# EasyEDA Pro project ADC2PWM_内置ESC.epro

# Schematic Schematic1_4
Board Name: 带屏幕_TPS63070_1; Create Date: 2026-05-16; Page Name: P1; Project Name: ADC2PWM; Schematic Name: Schematic1_3; Update Date: 2026-05-16; Company: 嘉立创EDA; Page Size: A4; Version: V1.0
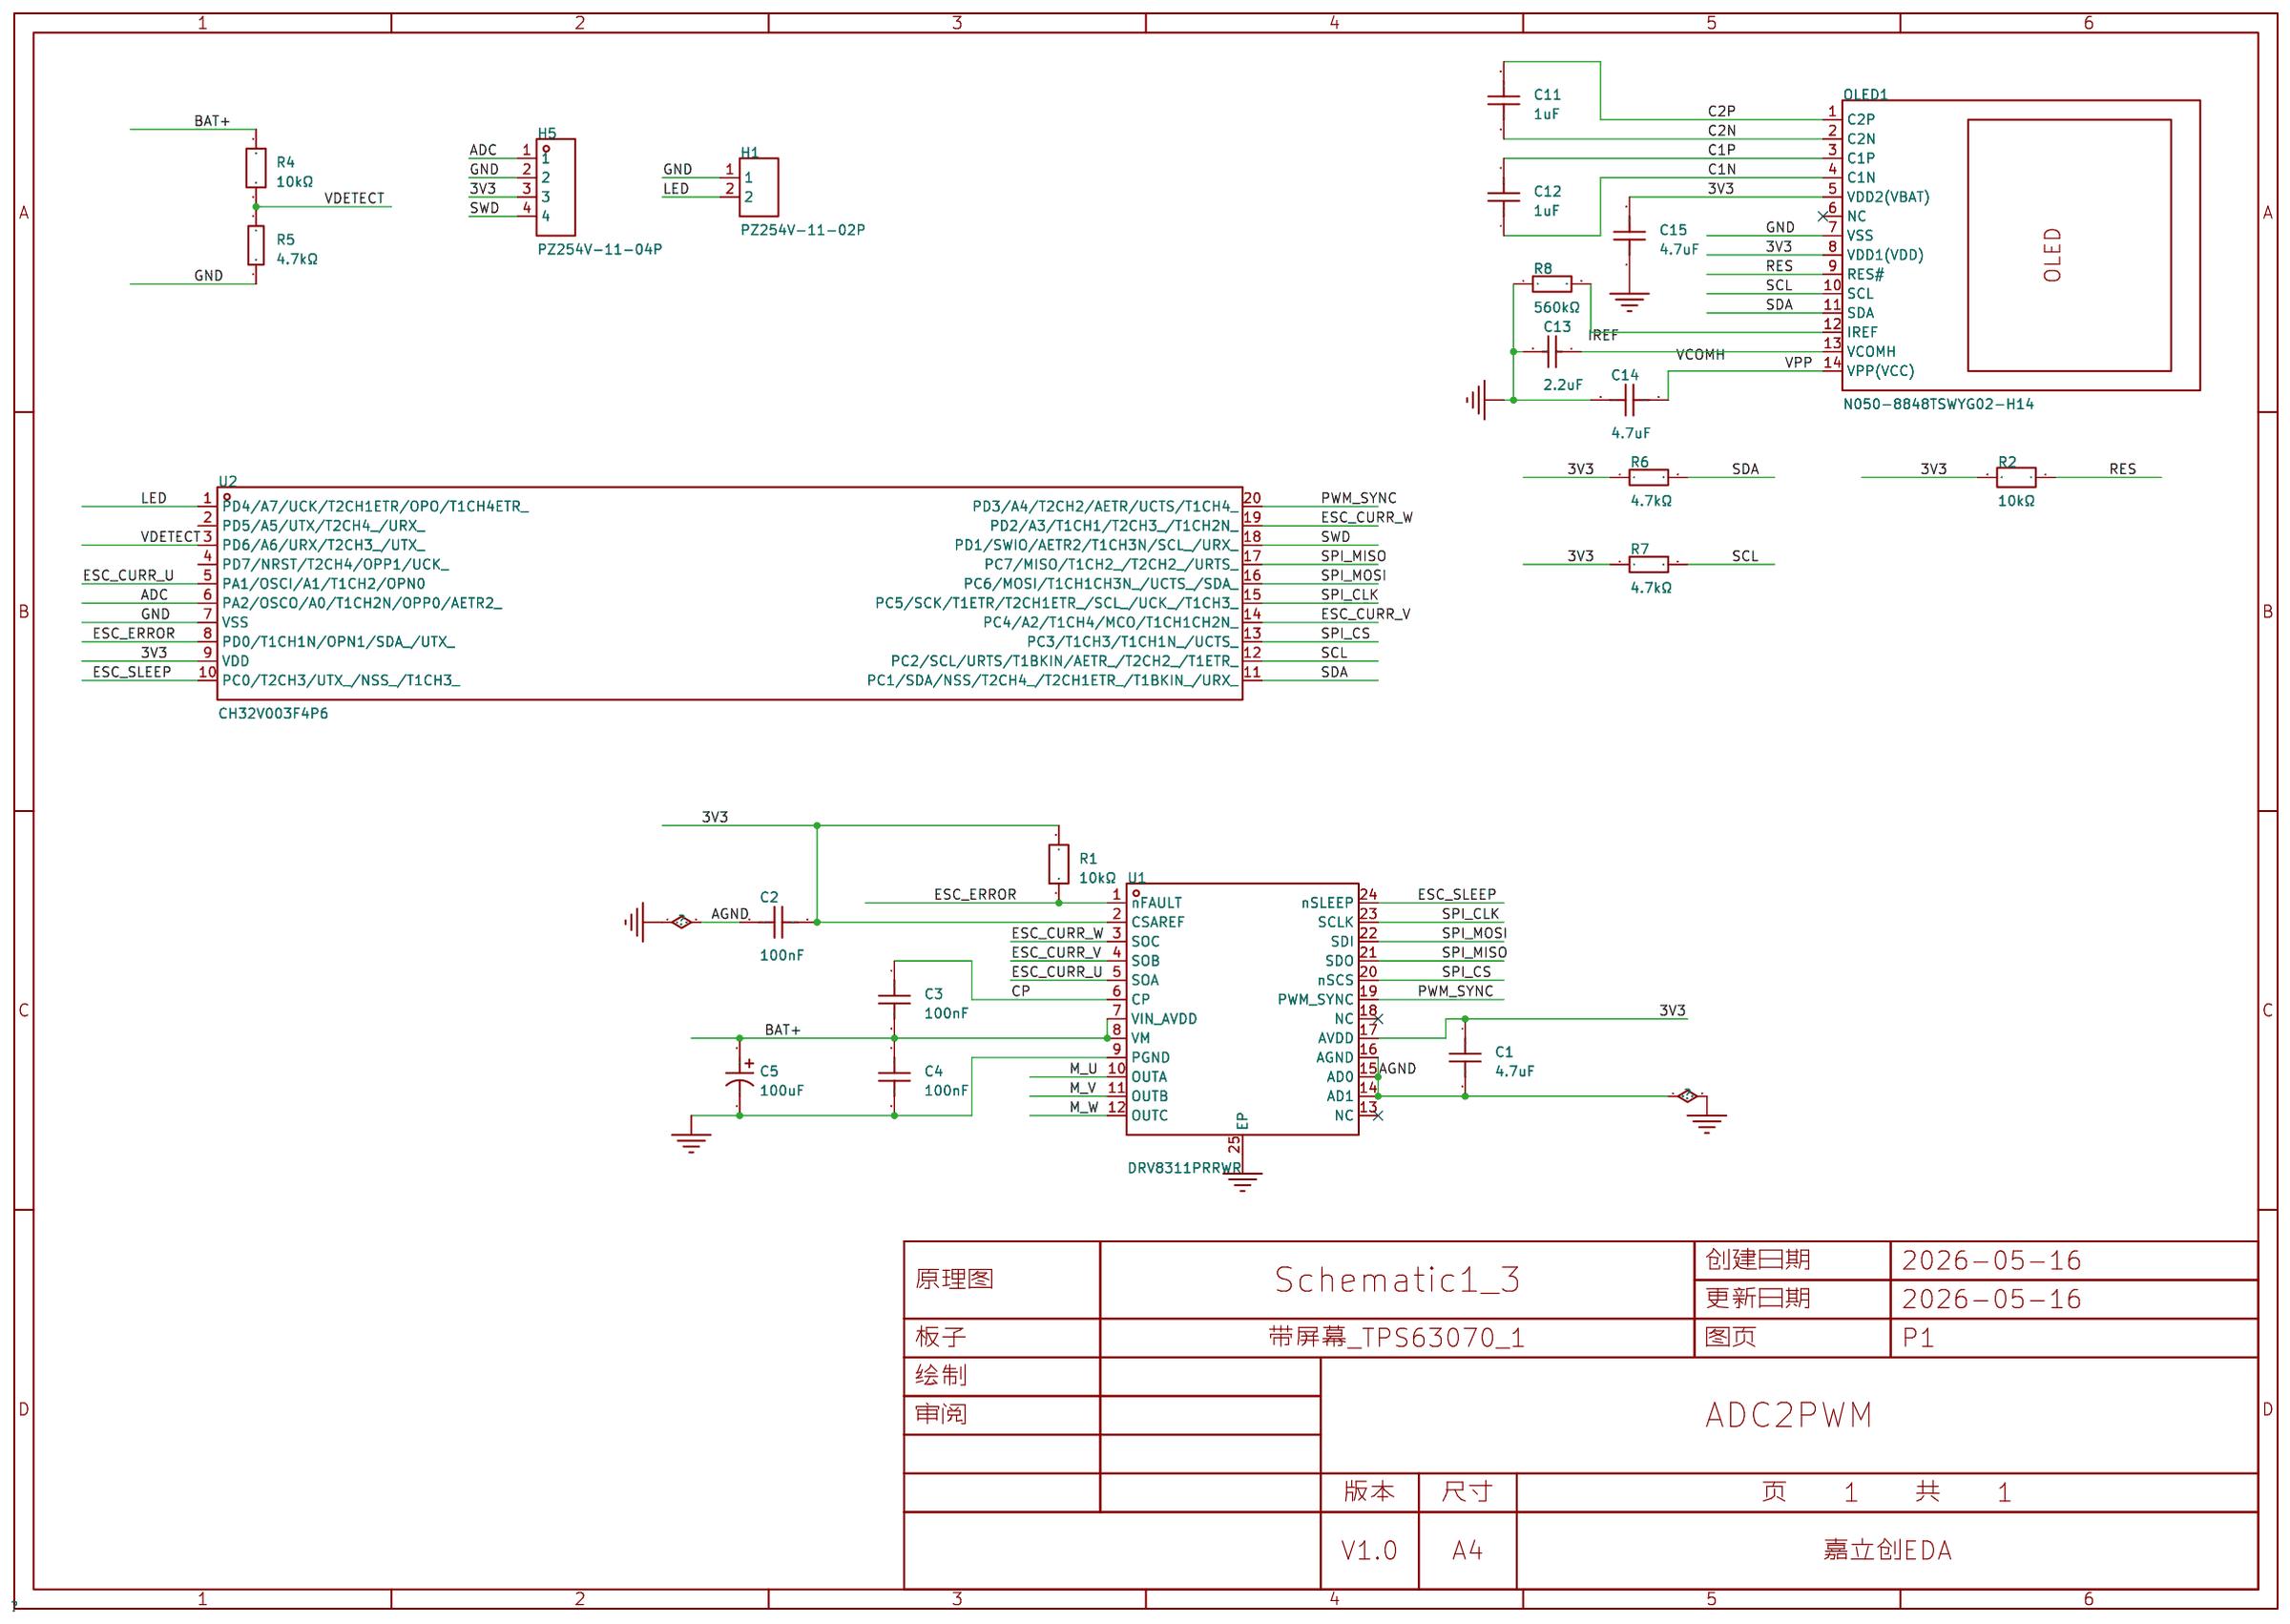
[diagram p0: schematic sheet]

## Parts
C1  4.7uF  [C0603]
C2  100nF  [C0603]
C3  100nF  [C0603]
C4  100nF  [C0603]
C5  100uF  [CAP-SMD_BD6.3-L6.6-W6.6-LS7.2-FD_3]
C11  1uF  [C0603]
C12  1uF  [C0603]
C13  2.2uF  [C0603]
C14  4.7uF  [C0603]
C15  4.7uF  [C0603]
H1  PZ254V-11-02P  [HDR-TH_2P-P2.54-V-M]
H5  PZ254V-11-04P  [HDR-TH_4P-P2.54-V-M]
OLED1  N050-8848TSWYG02-H14  [OLED-SMD_N050-8848TSWYG02-H14]
R1  10kΩ  [R0603]
R2  10kΩ  [R0603]
R4  10kΩ  [R0603]
R5  4.7kΩ  [R0603]
R6  4.7kΩ  [R0603]
R7  4.7kΩ  [R0603]
R8  560kΩ  [R0603]
U1  DRV8311PRRWR  [QFN-24_L3.0-W3.0-P0.40_DRV8311PRRWR]
U2  CH32V003F4P6  [TSSOP-20_L6.5-W4.4-P0.65-LS6.4-BL]

## Library data of the parts
C1 = GRM188Z71C475KE21D: 容值:4.7uF;精度:±10%;额定电压:16V;温度系数:X7R;; LCSC Part Name: 4.7uF ±10% 16V; Supplier Part: C389010; Manufacturer: muRata(村田); Supplier Footprint: 0603; JLCPCB Part Class: Extended Part; Datasheet: https://item.szlcsc.com/datasheet/GRM188Z71C475KE21D/364359.html; Supplier: LCSC; Tolerance: ±10%; Voltage Rating: 16V; Temperature Coefficient: X7R
C2-C4 = CGA0603X7R104K500JT: 容值:100nF;精度:±10%;额定电压:50V;温度系数:X7R;; LCSC Part Name: 100nF ±10% 50V; Supplier Part: C6119867; Manufacturer: HRE(芯声); Supplier Footprint: 0603; JLCPCB Part Class: 扩展库; Datasheet: https://item.szlcsc.com/datasheet/CGA0603X7R104K500JT/7062573.html; Supplier: LCSC; Tolerance: ±10%; Voltage Rating: 50V; Temperature Coefficient: X7R
C5 = JVJ16V100M6x5: 容值:100uF;精度:±20%;额定电压:16V;纹波电流:60mA@120Hz;; LCSC Part Name: 100uF ±20% 16V; Supplier Part: C46550396; Manufacturer: JIERR(捷而瑞); Supplier Footprint: SMD,D6.3xL5.4mm; JLCPCB Part Class: Extended Part; Datasheet: https://item.szlcsc.com/datasheet/JVJ16V100M6x5/48680090.html; Supplier: LCSC; Tolerance: ±20%; Voltage Rating: 16V; Ripple Current: 60mA@120Hz; Diameter: 6.3mm; Height - Seated (Max): 5.4mm; Lifetime: 2000hrs@105℃; Operating Temperature: -55℃~+105℃
C11 C12 = CGA0603X5R105K500JT: 容值:1uF;精度:±10%;额定电压:50V;温度系数:X5R;; LCSC Part Name: 1uF ±10% 50V; Supplier Part: C6119852; Manufacturer: HRE(芯声); Supplier Footprint: 0603; JLCPCB Part Class: 扩展库; Datasheet: https://item.szlcsc.com/datasheet/CGA0603X5R105K500JT/7062558.html; Supplier: LCSC; Tolerance: ±10%; Voltage Rating: 50V; Temperature Coefficient: X5R
C13 = CL10A225KO8NNNC: 容值:2.2uF;精度:±10%;额定电压:16V;温度系数:X5R;; LCSC Part Name: 2.2uF ±10% 16V; Supplier Part: C23630; Manufacturer: SAMSUNG(三星); Supplier Footprint: 0603; JLCPCB Part Class: 基础库; Datasheet: https://item.szlcsc.com/datasheet/CL10A225KO8NNNC/24366.html; Supplier: LCSC; Tolerance: ±10%; Voltage Rating: 16V; Temperature Coefficient: X5R
C14 C15 = CGA0603X5R475K250JT: 容值:4.7uF;精度:±10%;额定电压:25V;温度系数:X5R;; LCSC Part Name: 4.7uF ±10% 25V; Supplier Part: C6119856; Manufacturer: HRE(芯声); Supplier Footprint: 0603; JLCPCB Part Class: 扩展库; Datasheet: https://item.szlcsc.com/datasheet/CGA0603X5R475K250JT/7062562.html; Supplier: LCSC; Tolerance: ±10%; Voltage Rating: 25V; Temperature Coefficient: X5R
H1 = PZ254V-11-02P: 插针结构:1x2P;间距:2.54mm;行距:-;圆针/方针:方针;安装方式:直插;排数:单排;总PIN位数:2P;额定电流:3A;额定电压:250V;配合针长度:6mm;塑高:2.5mm;端接针长度:3mm;触头材质:黄铜;触头镀层:-;工作温度:-40℃~+105℃;颜色:黑色;; LCSC Part Name: 1x2P 间距:2.54mm 方针 直插; Supplier Part: C492401; Manufacturer: XFCN(兴飞); Supplier Footprint: 插件,P=2.54mm; JLCPCB Part Class: Extended Part; Datasheet: https://item.szlcsc.com/datasheet/PZ254V-11-02P/502957.html; Supplier: LCSC; Pin Structure: 1x2P; Pitch: 2.54mm; Circluar Pins/Square Pins: 方针; Mounting Type: 直插; Number of Rows: 单排; Number of Pins: 2P; Current Rating: 3A; Voltage Rating (Max): 250V; Length of Mating Pin: 6mm; Insulation Height: 2.5mm; Length of End Connection Pin: 3mm; Contact Material: 黄铜; Operating Temperature: -40℃~+105℃; Color: 黑色
H5 = PZ254V-11-04P: 插针结构:1x4P;间距:2.54mm;行距:-;圆针/方针:方针;安装方式:直插;排数:单排;总PIN位数:4P;额定电流:3A;额定电压:250V;配合针长度:6mm;塑高:2.5mm;端接针长度:3mm;触头材质:-;工作温度:-40℃~+105℃;颜色:黑色;; LCSC Part Name: 1x4P 间距:2.54mm 方针 直插; Supplier Part: C2691448; Manufacturer: XFCN(兴飞); Supplier Footprint: 插件,P=2.54mm; JLCPCB Part Class: 扩展库; Datasheet: https://item.szlcsc.com/datasheet/PZ254V-11-04P/2801085.html; Supplier: LCSC; Pin Structure: 1x4P; Pitch: 2.54mm; Circluar Pins/Square Pins: 方针; Mounting Type: 直插; Number of Rows: 单排; Number of Pins: 4P; Current Rating: 3A; Voltage Rating (Max): 250V; Length of Mating Pin: 6mm; Insulation Height: 2.5mm; Length of End Connection Pin: 3mm; Operating Temperature: -40℃~+105℃; Color: 黑色
OLED1 = N050-8848TSWYG02-H14: 核心芯片:CH1115芯片;尺寸(inch):0.5;像素分辨率:88x48;; LCSC Part Name: 0.50寸 白光 88x48像素分辨率 14PIN; Supplier Part: C2890604; Manufacturer: Wisevision(新智景); JLCPCB Part Class: 扩展库; Datasheet: https://item.szlcsc.com/datasheet/N050-8848TSWYG02-H14/3115552.html; Supplier: LCSC; Controller Type: CH1115芯片; Size: 0.5; Dot Pixels: 88x48; Operating Temperature: -40℃~+85℃; Type of Drive: 无源(PMOLED); Display Range: 6.124x11.244mm; Display Color: 白色; Luminance: 100cd/m2
R1 R2 R4 = FRC0603F1002TS: 电阻类型:厚膜电阻;阻值:10kΩ;精度:±1%;功率:100mW;工作电压:75V;温度系数:±100ppm/℃;; LCSC Part Name: 10kΩ ±1% 100mW 厚膜电阻; Supplier Part: C2906982; Manufacturer: FOJAN(富捷); Supplier Footprint: 0603; JLCPCB Part Class: 扩展库; Supplier: LCSC; Type: 厚膜电阻; Tolerance: ±1%; Power(Watts): 100mW; Voltage-Supply(Max): 75V; Temperature Coefficient: ±100ppm/℃; Operating Temperature: -55℃~+155℃
R5 = 0603WAF4701T5E: 电阻类型:厚膜电阻;阻值:4.7kΩ;精度:±1%;功率:100mW;工作电压:75V;温度系数:±100ppm/℃;; LCSC Part Name: 4.7kΩ ±1% 100mW 厚膜电阻; Supplier Part: C23162; Manufacturer: UNI-ROYAL(厚声); Supplier Footprint: 0603; JLCPCB Part Class: 基础库; Datasheet: https://item.szlcsc.com/datasheet/0603WAF4701T5E/23889.html; Supplier: LCSC; Type: 厚膜电阻; Tolerance: ±1%; Power(Watts): 100mW; Voltage-Supply(Max): 75V; Temperature Coefficient: ±100ppm/℃; Operating Temperature: -55℃~+155℃
R6 R7 = RC0603FR-074K7L: 电阻类型:厚膜电阻;阻值:4.7kΩ;精度:±1%;功率:100mW;工作电压:75V;温度系数:±100ppm/℃;; LCSC Part Name: 厚膜电阻 4.7kΩ ±1% 100mW; Supplier Part: C99782; Manufacturer: YAGEO(国巨); Supplier Footprint: 0603; JLCPCB Part Class: 扩展库; Datasheet: https://item.szlcsc.com/datasheet/RC0603FR-074K7L/100996.html; Supplier: LCSC; Type: 厚膜电阻; Tolerance: ±1%; Power(Watts): 100mW; Voltage-Supply(Max): 75V; Temperature Coefficient: ±100ppm/℃; Operating Temperature: -55℃~+155℃
R8 = RC0603FR-07560KL: 电阻类型:厚膜电阻;阻值:560kΩ;精度:±1%;功率:100mW;最大工作电压:75V;温度系数:±100ppm/℃;; LCSC Part Name: 厚膜电阻 560kΩ ±1% 100mW; Supplier Part: C137699; Manufacturer: YAGEO(国巨); Supplier Footprint: 0603; JLCPCB Part Class: 扩展库; Datasheet: https://atta.szlcsc.com/upload/public/pdf/source/20180821/C275644_0D56F95EFF785E7D9A1FEF436B37DA78.pdf; Supplier: LCSC; Type: 厚膜电阻; Tolerance: ±1%; Power(Watts): 100mW; Overload Voltage (Max): 75V; Temperature Coefficient: ±100ppm/℃; Operating Temperature Range: -55℃~+155℃
U1 = DRV8311PRRWR: DRV8311 具有集成 FET、最大绝对电压为 24V 的 3V 至 20V 三相无刷直流电机驱动器; LCSC Part Name: 5A 无刷直流BLDC电机驱动芯片 20V; Supplier Part: C3681458; Manufacturer: TI(德州仪器); Supplier Footprint: WQFN-24(3x3); JLCPCB Part Class: Extended Part; Datasheet: https://www.ti.com/cn/lit/gpn/drv8311; Supplier: LCSC; Drive Type: 三相；三相; Integrated FETs: 是；是; Number of Half Bridges: 3；3; Peak Current: 5A；5A; RDS(on): 210mΩ；210mΩ; Quiescent Current(Iq): 12mA；12mA; Interface: SPI; Operating Temperature: -40℃~+125℃；-40℃~+125℃
U2 = CH32V003F4P6: LCSC Part Name: QingKe V2微处理器; Supplier Part: C5187096; Manufacturer: WCH(南京沁恒); Supplier Footprint: TSSOP-20-175mil; JLCPCB Part Class: Extended Part; Datasheet: https://item.szlcsc.com/datasheet/CH32V003F4P6/5858783.html; Supplier: LCSC

## Nets
3V3: C1.1 C2.2 C15.2 H5.3 OLED1.5(VDD2(VBAT)) OLED1.8(VDD1(VDD)) R1.2 R2.2 R6.1 R7.1 U1.2(CSAREF) U1.17(AVDD) U2.9(VDD)
GND: C1.2 C2.1 C4.2 C5.2 C13.2 C14.2 C15.1 H1.1 H5.2 OLED1.7(VSS) R5.1 R8.1 U1.9(PGND) U1.14(AD1) U1.15(AD0) U1.16(AGND) U1.25(EP) U2.7(VSS)
ADC: H5.1 U2.6(PA2/OSCO/A0/T1CH2N/OPP0/AETR2_)
BAT+: C3.2 C4.1 C5.1 R4.2 U1.7(VIN_AVDD) U1.8(VM)
C1N: C12.1 OLED1.4(C1N)
C1P: C12.2 OLED1.3(C1P)
C2N: C11.1 OLED1.2(C2N)
C2P: C11.2 OLED1.1(C2P)
CP: C3.1 U1.6(CP)
ESC_CURR_U: U1.5(SOA) U2.5(PA1/OSCI/A1/T1CH2/OPN0)
ESC_CURR_V: U1.4(SOB) U2.14(PC4/A2/T1CH4/MCO/T1CH1CH2N_)
ESC_CURR_W: U1.3(SOC) U2.19(PD2/A3/T1CH1/T2CH3_/T1CH2N_)
ESC_ERROR: R1.1 U1.1(nFAULT) U2.8(PD0/T1CH1N/OPN1/SDA_/UTX_)
ESC_SLEEP: U1.24(nSLEEP) U2.10(PC0/T2CH3/UTX_/NSS_/T1CH3_)
IREF: OLED1.12(IREF) R8.2
LED: H1.2 U2.1(PD4/A7/UCK/T2CH1ETR/OPO/T1CH4ETR_)
M_U: U1.10(OUTA)
M_V: U1.11(OUTB)
M_W: U1.12(OUTC)
PWM_SYNC: U1.19(PWM_SYNC) U2.20(PD3/A4/T2CH2/AETR/UCTS/T1CH4_)
RES: OLED1.9(RES#) R2.1
SCL: OLED1.10(SCL) R7.2 U2.12(PC2/SCL/URTS/T1BKIN/AETR_/T2CH2_/T1ETR_)
SDA: OLED1.11(SDA) R6.2 U2.11(PC1/SDA/NSS/T2CH4_/T2CH1ETR_/T1BKIN_/URX_)
SPI_CLK: U1.23(SCLK) U2.15(PC5/SCK/T1ETR/T2CH1ETR_/SCL_/UCK_/T1CH3_)
SPI_CS: U1.20(nSCS) U2.13(PC3/T1CH3/T1CH1N_/UCTS_)
SPI_MISO: U1.21(SDO) U2.17(PC7/MISO/T1CH2_/T2CH2_/URTS_)
SPI_MOSI: U1.22(SDI) U2.16(PC6/MOSI/T1CH1CH3N_/UCTS_/SDA_)
SWD: H5.4 U2.18(PD1/SWIO/AETR2/T1CH3N/SCL_/URX_)
VCOMH: C13.1 OLED1.13(VCOMH)
VDETECT: R4.1 R5.2 U2.3(PD6/A6/URX/T2CH3_/UTX_)
VPP: C14.1 OLED1.14(VPP(VCC))

Not connected (* = marked no-connect by the designer): OLED1 6(NC)*; U1 13(NC)* 18(NC)*; U2 2(PD5/A5/UTX/T2CH4_/URX_) 4(PD7/NRST/T2CH4/OPP1/UCK_)

# Board PCB1_4
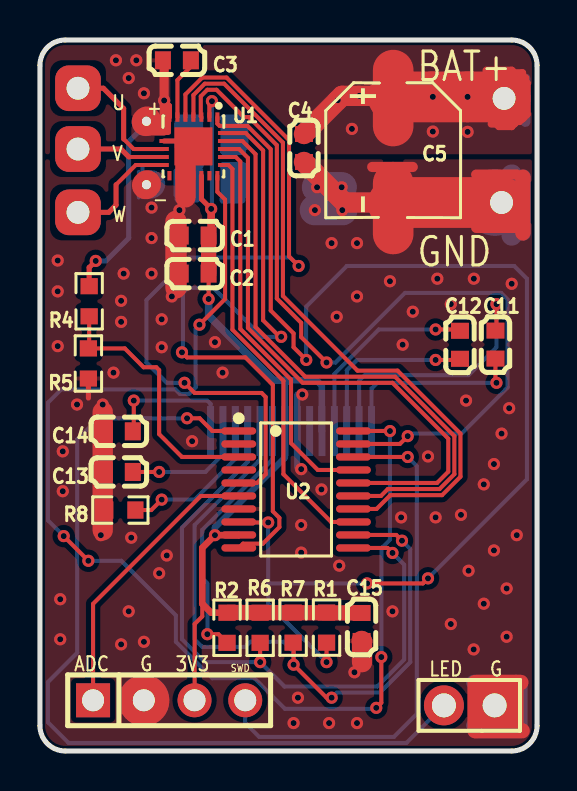
[diagram p1: board, top side]
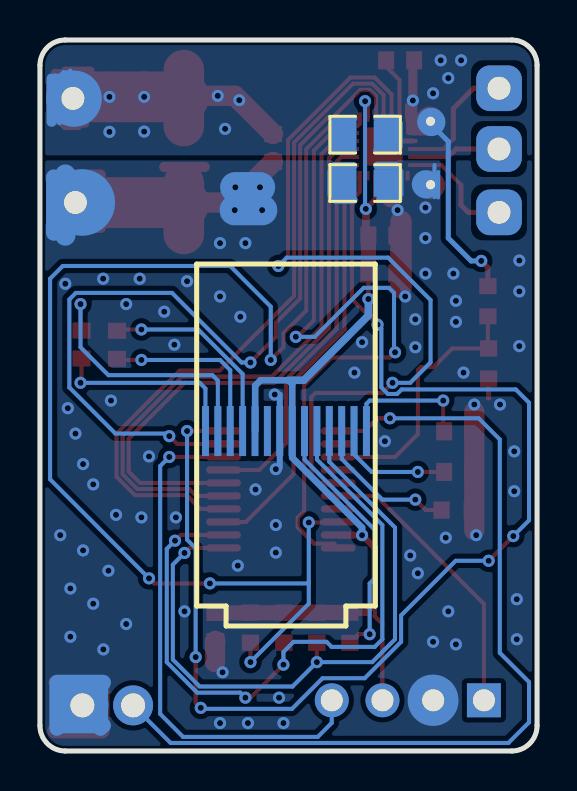
[diagram p2: board, bottom side, seen from below]

Outline 24.89 x 35.56 mm; copper layers: Top Layer, Bottom Layer. Coordinates in mm from the lower left corner of the outline.
Outline path: 0,34.29 0,1.27 arc(0.37,0.37) 1.27,0 23.62,0 arc(24.52,0.37) 24.89,1.27 24.89,34.29 arc(24.52,35.19) 23.62,35.56 1.27,35.56 arc(0.37,35.19) 0,34.29
Stack: Top Layer 0.035mm / Dielectric1 1.51mm FR4 er 4.5 / Bottom Layer 0.035mm

## Design rules (mm)
spacing copperThickness1oz (default): track to track 0.102, other pairs 0.152 to 0.3
spacing copperThickness2oz: track to track 0.203, other pairs 0.152 to 0.3
spacing Plane_innerPlane: track to track 0.102, other pairs 0.152 to 0.3
spacing Copper_copperRegion: track to track 0.102, other pairs 0.152 to 0.3
track width copperThickness1oz (default): min 0.127, default 0.203, max 2.54
track width copperThickness2oz: min 0.203, default 0.254, max 2.54
track width power: min 0.254, default 0.254, max 2.54
differential pair differentialPair (default): width min 0.127, default 0.254, max 2.54; gap min 0.152, default 0.152
net BAT+ uses copperRegion_copperThickness1oz, power
net GND uses copperRegion_copperThickness1oz, power
pour e160 uses Copper_copperRegion, copperRegion_Copper_copperRegion
pour e209 uses Copper_copperRegion, copperRegion_Copper_copperRegion

## Placement (name value [footprint] x y rotation side)
C1  4.7uF  [C0603]  7.75 25.78 180 top
C2  100nF  [C0603]  7.75 23.88 0 top
C3  100nF  [C0603]  6.86 34.54 180 top
C4  100nF  [C0603]  13.22 30.16 270 top
C5  100uF  [CAP-SMD_BD6.3-L6.6-W6.6-LS7.2-FD_3]  17.69 30.05 270 top
C11  1uF  [C0603]  22.81 20.32 270 top
C12  1uF  [C0603]  21.03 20.32 270 top
C13  2.2uF  [C0603]  3.95 13.96 180 top
C14  4.7uF  [C0603]  3.95 15.99 180 top
C15  4.7uF  [C0603]  16.11 6.2 90 top
H1  PZ254V-11-02P  [HDR-TH_2P-P2.54-V-M]  21.5 2.28 180 top
H5  PZ254V-11-04P  [HDR-TH_4P-P2.54-V-M]  6.47 2.54 0 top
NOREF  -  [Pad_e366]  5.33 31.5 180 top
NOREF#2  -  [Pad_e95]  23.11 27.43 0 top
NOREF#3  -  [Pad_e90]  1.91 33.15 0 top
NOREF#4  -  [Pad_e367]  5.33 28.32 180 top
NOREF#5  -  [Pad_e92]  1.91 26.94 0 top
NOREF#6  -  [Pad_e91]  1.91 30.11 0 top
NOREF#7  -  [Pad_e94]  23.24 32.64 0 top
OLED1  N050-8848TSWYG02-H14  [OLED-SMD_N050-8848TSWYG02-H14]  12.57 16 180 bottom
R1  10kΩ  [R0603]  14.35 6.17 90 top
R2  10kΩ  [R0603]  9.37 6.16 90 top
R3  0Ω  [R0805]  8.61 30.82 180 bottom
R4  10kΩ  [R0603]  2.46 22.49 90 top
R5  4.7kΩ  [R0603]  2.43 19.38 90 top
R6  4.7kΩ  [R0603]  11.03 6.16 270 top
R7  4.7kΩ  [R0603]  12.68 6.17 270 top
R8  560kΩ  [R0603]  4.03 12.05 0 top
R9  0Ω  [R0805]  8.61 28.41 180 bottom
U1  DRV8311PRRWR  [QFN-24_L3.0-W3.0-P0.40_DRV8311PRRWR]  7.68 30.24 270 top
U2  CH32V003F4P6  [TSSOP-20_L6.5-W4.4-P0.65-LS6.4-BL]  12.83 13.08 270 top

## Footprints (pads in the part's own frame, mm; a bottom-side part is the same pattern mirrored in y, then rotated)
C0603
  rect 0.8x0.9 smd: 1(-0.7,0) 2(0.7,0)
CAP-SMD_BD6.3-L6.6-W6.6-LS7.2-FD_3
  rect 3.5x1.2 smd: 1(-2.67,0) 2(2.67,0)
HDR-TH_2P-P2.54-V-M
  rect 2x2 hole 1.2: 1(-1.27,0)
  round 2 hole 1.2: 2(1.27,0)
HDR-TH_4P-P2.54-V-M
  rect 1.7x1.7 hole 1.1: 1(-3.81,0)
  round 1.7 hole 1.1: 2(-1.27,0) 3(1.27,0) 4(3.81,0)
OLED-SMD_N050-8848TSWYG02-H14
  rect 0.35x2.5 smd: 1(-4.03,0) 2(-3.41,0) 3(-2.79,0) 4(-2.17,0) 5(-1.55,0) 6(-0.93,0) 7(-0.31,0) 8(0.31,0) 9(0.93,0) 10(1.55,0) 11(2.17,0) 12(2.79,0) 13(3.41,0) 14(4.03,0)
Pad_e90
  rrect 2.286x2.286 hole 1.143: 1(0,0)
Pad_e91
  rrect 2.286x2.286 hole 1.143: 2(0,0)
Pad_e92
  rrect 2.286x2.286 hole 1.143: 3(0,0)
Pad_e94
  round 2.286 hole 1.143: 1(0,0)
Pad_e95
  rrect 2.286x2.286 hole 1.143: 2(0,0)
Pad_e366
  round 0.762 hole 0.457: 1(0,0)
Pad_e367
  round 0.762 hole 0.457: 1(0,0)
QFN-24_L3.0-W3.0-P0.40_DRV8311PRRWR
  rect 0.47x0.2 smd: 1(-1.465,1.2) 2(-1.465,0.8) 3(-1.465,0.4) 4(-1.465,0) 5(-1.465,-0.4) 6(-1.465,-0.8) 7(-1.465,-1.2) 13(1.465,-1.2) 14(1.465,-0.8) 15(1.465,-0.4) 16(1.465,0) 17(1.465,0.4) 18(1.465,0.8) 19(1.465,1.2)
  rect 0.2x0.47 smd: 8(-0.67,-1.465) 9(-0.27,-1.465) 10(0.13,-1.465) 11(0.53,-1.465) 12(0.93,-1.465) 20(0.93,1.465) 21(0.53,1.465) 22(0.13,1.465) 23(-0.27,1.465) 24(-0.67,1.465)
  rect 1.9x1.9 smd: 25(0,0)
R0603
  rect 0.806x0.864 smd: 1(-0.753,0) 2(0.753,0)
R0805
  rect 1.133x1.377 smd: 1(-1,0) 2(1,0)
TSSOP-20_L6.5-W4.4-P0.65-LS6.4-BL
  oval 0.364x1.742 smd: 1(-2.925,-2.871) 2(-2.275,-2.871) 3(-1.625,-2.871) 4(-0.975,-2.871) 5(-0.325,-2.871) 6(0.325,-2.871) 7(0.975,-2.871) 8(1.625,-2.871) 9(2.275,-2.871) 10(2.925,-2.871) 11(2.925,2.871) 12(2.275,2.871) 13(1.625,2.871) 14(0.975,2.871) 15(0.325,2.871) 16(-0.325,2.871) 17(-0.975,2.871) 18(-1.625,2.871) 19(-2.275,2.871) 20(-2.925,2.871)

## Nets
As in the schematic, except:
GND: C1.2 C2.1 C4.2 C5.2 C13.2 C14.2 C15.1 H1.1 H5.2 NOREF#2.2 NOREF#4.1 OLED1.7 R5.1 R8.1 R9.1 R9.2 U1.9 U1.14 U1.15 U1.16 U1.25 U2.7
BAT+: C3.2 C4.1 C5.1 NOREF.1 NOREF#7.1 R3.1 R3.2 R4.2 U1.7 U1.8
M_U: NOREF#3.1 U1.10
M_V: NOREF#6.2 U1.11
M_W: NOREF#5.3 U1.12

Pads without a net: OLED1 6; U1 13 18; U2 2 4

## Via types
v1: diameter 0.61, hole 0.305, Top Layer to Bottom Layer, 123 vias

## Routing (per net, layer and track width the routed paths; a pad name or vN(x,y) marks a point on that pad's centre or on a via; arc(x,y) is an arc through that point)
3V3: length 50.2
  Top Layer w0.203: H5.3 7.75,2.54 7.75,6.35 8.13,6.73 8.13,7.37 ; 8.48,31.7 8.48,32.37 v1(8.61,32.5) ; C2.2 v1(8.45,22.61)
  Top Layer w0.254: U1.17 8.08,27.6 v1(8.57,27.11)
  Top Layer w0.33: U2.9 9.95,10.8 v1(8.76,10.8) 8.13,10.16 8.13,7.37 8.58,6.92 R2.2
  Top Layer w0.381: v1(8.57,27.11) 8.57,25.91 C1.1
  Top Layer w0.762: 9.41,6.93 C15.2 ; C2.2 C1.1
  Bottom Layer w0.203: v1(8.57,27.11) 8.61,27.15 v1(8.61,32.5)
  Bottom Layer w0.33: OLED1.5 14.11,16.01 14.11,18.27 13.84,18.54 12.45,18.54 12.26,18.36 OLED1.8 12.26,14.68 8.76,11.18 v1(8.76,10.8)
  Bottom Layer w0.381: 12.45,18.54 11.68,18.54 8.45,21.78 v1(8.45,22.61)
GND: length 18.6
  Top Layer w0.254: U1.9 7.41,30.51 U1.25 ; R5.1 2.43,17.65
  Top Layer w1.016: C15.1 16.13,5.48 16.13,4.44 ; 17.69,27.38 17.63,27.43 15.5,27.43 ; 7.28,29.41 U1.15 7.28,27.69 ; C4.2 15.25,27.43
  Top Layer w1.397: 5.36,28.35 5.31,28.29
  Top Layer w2.54: 17.69,27.38 17.74,27.43 NOREF#2.2
  Bottom Layer w1.397: 5.57,28.35 5.56,28.33
  Bottom Layer w1.524: v1(15.11,28.19) v1(13.88,28.19) ; v1(15.14,27.05) v1(13.77,27.05)
  vias: v1(0.89,24.53) v1(0.89,22.99) v1(0.89,20.25) v1(1.02,7.59) v1(1.02,5.59) v1(1.14,14.99) v1(1.14,12.99) v1(1.86,17.33) v1(3.05,10.8) v1(3.14,17.33) v1(3.68,18.92) v1(4.06,22.52) v1(4.06,21.46) v1(4.06,5.33) v1(4.19,23.88) v1(4.44,6.98) v1(4.57,10.67) v1(5.21,5.46) v1(5.59,27.18) v1(5.59,25.65) v1(5.59,23.88) v1(5.97,8.89) v1(6.1,21.59) v1(6.1,20.19) v1(6.35,9.78) v1(6.6,22.73) v1(6.98,27.05) v1(7.62,15.49) v1(8.76,20.45) v1(9.14,18.92) v1(12.7,1.4) v1(12.92,2.67) v1(13.08,14.1) v1(13.08,11.3) v1(13.08,9.92) v1(13.14,17.83) v1(14.1,13.08) v1(14.48,1.4) v1(14.6,25.4) v1(14.86,21.72) v1(14.99,9.27) v1(15.75,3.94) v1(15.88,25.4) v1(15.88,22.73) v1(15.88,1.4) v1(17.53,23.49) v1(17.65,6.98) v1(18.08,11.68) v1(18.16,20.32) v1(18.67,21.97) v1(19.43,14.73) v1(19.81,11.68) v1(19.9,23.62) v1(20.57,22.35) v1(20.57,6.35) v1(21.08,11.81) v1(21.34,17.53) v1(21.46,9.02) v1(21.73,23.62) v1(21.72,5.08) v1(22.22,13.33) v1(22.22,7.37) v1(22.73,14.35) v1(22.73,10.03) v1(23.11,15.88) v1(23.37,8.13) v1(23.37,5.71) v1(23.49,17.14) v1(23.62,23.37) v1(23.88,10.8)
ADC: length 14.4
  Top Layer w0.203: H5.1 2.66,7.36 8.06,12.76 U2.6
BAT+: length 26
  Top Layer w0.254: v1(6.22,32.53) 6.48,32.27 6.48,31.7 ; U1.8 5.46,30.91 ; R4.2 2.46,24.18 v1(2.79,24.51)
  Top Layer w0.457: 6.22,34.48 v1(6.22,32.53) 6.22,31.03
  Top Layer w1.016: C4.1 v1(14.91,32.55) 15.13,32.77 v1(15.99,32.77) 17.64,32.77 C5.1
  Top Layer w1.423: 5.36,31.52 5.31,31.47
  Top Layer w2.54: C5.1 v1(19.67,32.72) v1(21.41,32.72) 23.16,32.72 NOREF#7.1
  Bottom Layer w0.254: v1(2.79,24.51) 3.3,24.51 4.44,25.65 4.44,30.48 5.21,31.24 5.21,31.75
  Bottom Layer w1.397: 5.31,31.47 5.29,31.45
  vias: v1(3.8,34.54) v1(4.44,33.66) v1(4.83,34.54) v1(5.21,32.89) v1(15.62,31.11) v1(19.67,30.98) v1(21.41,30.96)
C1N: length 10.1
  Top Layer w0.203: C12.1 20.97,21.08 v1(19.81,21.08)
  Bottom Layer w0.203: v1(19.81,21.08) 16.97,21.08 14.74,18.86 OLED1.4
C1P: length 8.9
  Top Layer w0.203: C12.2 20.97,19.56 v1(19.81,19.56)
  Bottom Layer w0.203: v1(19.81,19.56) 15.88,19.56 15.36,19.05 OLED1.3
C2N: length 13.6
  Top Layer w0.203: C11.1 22.86,21.08 v1(22.86,22.35)
  Bottom Layer w0.203: OLED1.2 15.98,18.52 16.26,18.8 21.46,18.8 22.86,20.19 v1(22.86,22.35)
C2P: length 9.7
  Top Layer w0.203: v1(22.86,18.41) 22.81,18.47 22.81,19.62
  Bottom Layer w0.203: OLED1.1 16.6,18.13 16.89,18.41 v1(22.86,18.41)
CP: length 3.1
  Top Layer w0.203: C3.1 7.56,34.23 6.88,33.55 6.88,31.7
ESC_CURR_U: length 38.3
  Top Layer w0.203: 7.28,31.7 7.28,32.84 8.13,33.68 9.35,33.68 12.47,30.55 12.47,24.74 v1(12.95,24.26) ; U2.5 10.87,13.41 11.3,13.84 11.3,17.7 11.1,17.91 7.75,17.91 v1(7.24,18.41)
  Bottom Layer w0.203: v1(12.95,24.26) 12.53,24.68 7.45,24.68 5.33,22.55 5.33,19.43 6.35,18.41 v1(7.24,18.41)
ESC_CURR_V: length 34.6
  Top Layer w0.203: 7.68,31.7 7.68,32.81 8.25,33.38 9.22,33.38 12.17,30.43 12.17,22.76 15.9,19.02 17.91,19.02 21.06,15.87 21.06,13.72 20.14,12.8 17.55,12.8 16.85,12.11 U2.14
ESC_CURR_W: length 42
  Top Layer w0.203: U2.19 18.02,15.36 v1(18.41,15.75) ; 8.08,31.7 8.05,31.73 8.05,32.74 8.38,33.07 8.84,33.07 10.21,31.7 10.46,31.7 11.86,30.3 11.86,22.63 13.08,21.41 13.08,20.7 v1(14.35,19.43)
  Bottom Layer w0.203: v1(18.41,15.75) 18.54,15.88 21.11,15.88 23.42,18.18 23.42,22.58 23.09,22.91 18.28,22.91 14.8,19.43 v1(14.35,19.43)
ESC_ERROR: length 65.5
  Top Layer w0.203: 8.88,31.7 8.88,31.37 9,31.26 10.39,31.26 11.56,30.1 11.56,22.03 12.7,20.88 12.7,20.19 v1(13.33,19.56) ; v1(19.43,8.64) 19.18,8.38 v1(16.38,8.38) ; R1.1 v1(14.35,4.44) ; U2.8 9.98,11.43 v1(11.43,11.43)
  Bottom Layer w0.203: v1(13.33,19.56) 13.33,22.22 15.37,24.26 23.75,24.26 24.38,23.62 24.38,13.59 v1(19.43,8.64) ; 11.43,8.46 11.51,8.38 v1(16.38,8.38) ; 11.43,8.46 11.43,7.37 v1(14.35,4.44) ; 11.43,8.46 v1(11.43,11.43)
ESC_SLEEP: length 36.1
  Top Layer w0.203: U1.24 10.3,30.91 11.18,30.03 11.18,21.54 12.04,20.68 ; U2.10 10.17,10.37 11.16,10.37 11.99,11.2 11.99,11.66 11.66,11.99 11.66,18.31 10.29,19.68 7.37,19.68 v1(7.11,19.94)
  Bottom Layer w0.203: v1(12.08,20.71) 11.13,20.71 8.68,23.16 7.42,23.16 7.16,22.91 7.16,19.99 v1(7.11,19.94)
IREF: length 7.5
  Top Layer w0.203: v1(6.1,12.57) 5.57,12.05 R8.2
  Bottom Layer w0.203: v1(6.1,12.57) 7.75,12.57 9.78,14.6 9.78,16 OLED1.12
LED: length 44.6
  Top Layer w0.203: v1(7.37,16.64) 8,16.64 8.63,16.01 U2.1
  Bottom Layer w0.203: H1.2 18.35,0.4 1.44,0.4 0.4,1.44 0.4,3.45 1.87,4.91 1.87,15.58 2.92,16.64 v1(7.37,16.64)
M_U: length 6.5
  Top Layer w0.203: 4.19,30.61 4.69,30.11 U1.10
  Top Layer w0.254: 4.19,30.61 4.19,32.13 3.17,33.15 NOREF#3.1
M_V: length 4.5
  Top Layer w0.203: U1.11 4.45,29.71
  Top Layer w0.254: 4.45,29.71 4.06,30.11 NOREF#6.2
M_W: length 5.9
  Top Layer w0.203: U1.12 4.8,29.31 3.81,28.32
  Top Layer w0.254: 3.81,28.32 3.81,27.3 3.44,26.94 NOREF#5.3
PWM_SYNC: length 62.2
  Top Layer w0.203: U2.20 17.52,16.01 v1(17.53,16) ; v1(7.99,21.32) 9.27,22.61 9.27,27.58 8.88,27.96 U1.19 ; v1(17.09,4.7) 17.09,2.41 v1(16.84,2.16) ; v1(1.19,10.75) v1(2.42,9.51)
  Bottom Layer w0.203: v1(17.53,16) 17.53,10.57 17.09,10.14 v1(17.09,4.7) ; v1(16.84,2.16) 16.79,2.11 12.27,2.11 10.74,3.64 8.63,3.64 6.81,5.46 6.81,6.78 4.08,9.51 v1(2.42,9.51) ; v1(7.99,21.32) 7.8,21.13 7.8,18.18 7.47,17.86 7.01,17.86 6.78,18.08 1.07,18.08 0.4,17.42 0.4,11.54 v1(1.19,10.75)
RES: length 12.9
  Top Layer w0.203: v1(8.38,5.84) 8.94,5.84 R2.1
  Bottom Layer w0.203: OLED1.9 11.64,14.58 8.13,11.06 8.13,8.64 8.38,8.38 v1(8.38,5.84)
SCL: length 35
  Top Layer w0.203: U2.12 17.84,10.81 v1(18.13,10.52) ; v1(14.6,2.67) 14.35,2.67 v1(12.7,4.32) 12.7,5.39 R7.2
  Bottom Layer w0.203: OLED1.10 11.02,14.58 7.75,11.3 7.75,5.59 8.13,5.21 10.29,5.21 10.54,5.46 12.19,5.46 12.7,4.95 v1(12.7,4.32) ; v1(14.6,2.67) 14.86,2.92 17.02,2.92 18.54,4.44 18.54,10.11 v1(18.13,10.52)
SDA: length 33
  Top Layer w0.203: v1(17.65,9.91) 17.4,10.16 U2.11 ; R6.2 v1(11.03,4.44)
  Bottom Layer w0.203: v1(17.65,9.91) 18.24,9.32 18.24,4.57 16.89,3.23 12.24,3.23 v1(11.03,4.44) 8.25,4.44 7.11,5.59 7.11,11.18 10.4,14.47 OLED1.11
SPI_CLK: length 30.2
  Top Layer w0.203: U1.23 10.14,30.51 10.79,29.85 10.79,21.21 13.28,18.72 17.78,18.72 20.75,15.75 20.75,13.84 20.01,13.1 17.42,13.1 17.07,12.76 U2.15
SPI_CS: length 21.4
  Top Layer w0.203: U2.13 14.58,11.46 12.19,13.84 12.19,18.52 9.64,21.07 9.64,29.1 9.44,29.31 U1.20
SPI_MISO: length 19.8
  Top Layer w0.203: U2.17 13.91,14.06 12.57,15.4 12.57,18.57 10.03,21.11 10.03,29.48 9.8,29.71 U1.21
SPI_MOSI: length 28.9
  Top Layer w0.203: U2.16 19.88,13.41 20.45,13.97 20.45,15.62 17.65,18.41 13.16,18.41 10.41,21.16 10.41,29.66 9.97,30.11 U1.22
SWD: length 26.2
  Top Layer w0.203: U2.18 v1(18.41,14.71)
  Bottom Layer w0.203: v1(18.41,14.71) 18.87,14.25 18.87,1.85 17.72,0.71 10.98,0.71 10.28,1.4 H5.4
VCOMH: length 6
  Top Layer w0.203: C13.1 v1(5.97,13.96)
  Bottom Layer w0.203: OLED1.13 9.14,15.98 9.14,14.82 8.28,13.96 v1(5.97,13.96)
VDETECT: length 13.3
  Top Layer w0.203: 2.46,21.74 2.46,20.17 R5.2 4.25,20.13 5.19,19.19 5.83,19.19 5.97,19.05 5.97,15.85 7.11,14.71 U2.3
VPP: length 6.8
  Top Layer w0.203: v1(4.7,17.53) 4.7,16.04 C14.1
  Bottom Layer w0.203: OLED1.14 8.54,17.36 8.38,17.53 v1(4.7,17.53)

## Copper pours and planes (outline as drawn; the poured copper is in the pictures)
GND on Top Layer: -1.78,29.71 25.83,29.71 25.83,-0.38 -1.78,-0.38
GND on Bottom Layer: -1.91,29.59 26.8,29.59 26.8,-1.14 -1.91,-1.14
BAT+ on Top Layer: -1.52,36.96 25.78,36.96 25.78,29.84 -1.52,29.84
BAT+ on Bottom Layer: -0.92,37.72 26.54,37.72 26.54,29.79 -0.92,29.79

## Text on the board
Top Silkscreen Layer: SWD | ADC | U | V | W | G | + | - | 3V3 | LED | BAT+ | GND
